# EAGLE schematic Adafruit ItsyBitsy nRF52840 Express (EAGLE 9.6.2)
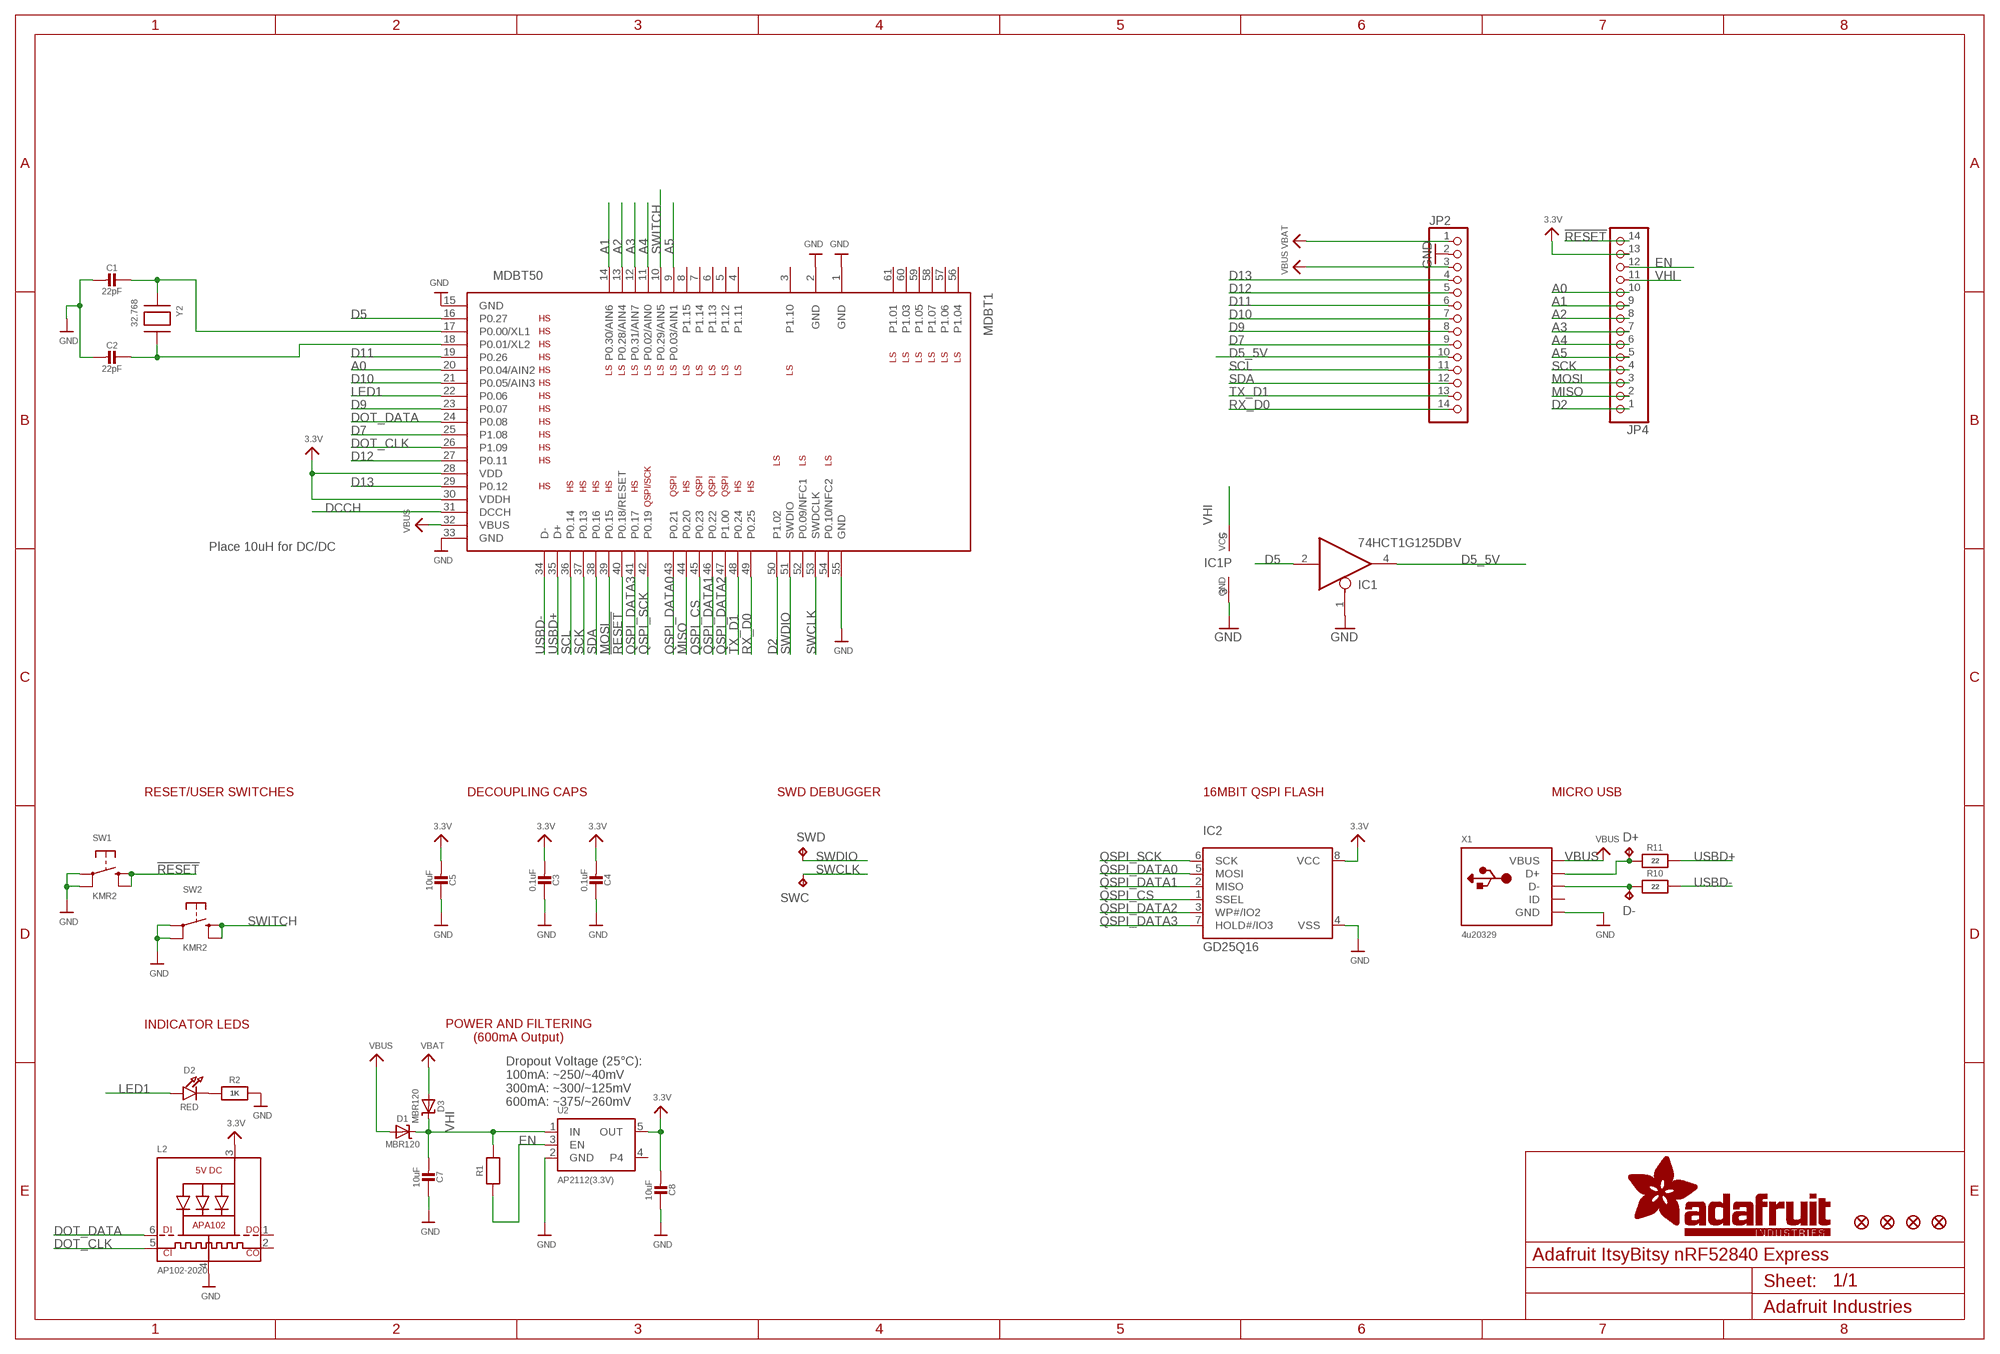
[diagram p0: schematic, sheet 1]

## Parts
C1  22pF  CAP_CERAMIC_0603MP  [_0603MP]
C2  22pF  CAP_CERAMIC_0603MP  [_0603MP]
C3  0.1uF  CAP_CERAMIC0603_NO  [0603-NO]
C4  0.1uF  CAP_CERAMIC0603_NO  [0603-NO]
C5  10uF  CAP_CERAMIC0805-NOOUTLINE  [0805-NO]
C7  10uF  CAP_CERAMIC0805-NOOUTLINE  [0805-NO]
C8  10uF  CAP_CERAMIC0805-NOOUTLINE  [0805-NO]
D1  MBR120  DIODE-SCHOTTKYSOD-123  [SOD-123]
D2  RED  LED0805_NOOUTLINE  [CHIPLED_0805_NOOUTLINE]
D3  MBR120  DIODE-SCHOTTKYSOD-123  [SOD-123]
D+  TPTP10R  [TP10R]
D-  TPTP10R  [TP10R]
FID1  FIDUCIAL_1MM  [FIDUCIAL_1MM]
FID2  FIDUCIAL_1MM  [FIDUCIAL_1MM]
FID3  FIDUCIAL_1MM  [FIDUCIAL_1MM]
FID4  FIDUCIAL_1MM  [FIDUCIAL_1MM]
IC1  74HCT1G125DBV  74AHC1G125DBV  [SOT23-5]
IC2  GD25Q16  SPIFLASH_8PINUX  [USON8]
JP2  HEADER-1X14  [1X14_ROUND70]
JP4  HEADER-1X14  [1X14_ROUND70]
L2  AP102-2020  APA1022020  [APA102_2020]
MDBT1  MDBT50  [MDBT50]
R1  10K  RESISTOR_0603_NOOUT  [0603-NO]
R2  1K  RESISTOR_0603_NOOUT  [0603-NO]
R10  22  RESISTOR_0603_NOOUT  [0603-NO]
R11  22  RESISTOR_0603_NOOUT  [0603-NO]
SW1  KMR2  SWITCH_TACT_SMT4.6X2.8  [BTN_KMR2_4.6X2.8]
SW2  KMR2  SWITCH_TACT_SMT4.6X2.8  [BTN_KMR2_4.6X2.8]
SWC  TPTP13R  [TP13R]
SWD  TPTP13R  [TP13R]
U2  AP2112(3.3V)  VREG_SOT23-5  [SOT23-5]
X1  4u20329  USB_MICRO_20329_V2  [4UCONN_20329_V2]
Y2  32.768  XTAL-3.2X1.5  [XTAL3215]

## Nets
3.3V [power]: C3.2 C4.2 C5.2 C8.2 IC2.8(VCC) JP4.13 L2.3(VDD) MDBT1.28(VDD) MDBT1.30(VDDH) U2.5(OUT)
!RESET: JP4.14 MDBT1.40(P0.18/RESET) SW1.B'(S1) SW1.B(S)
A0: JP4.10 MDBT1.20(P0.04/AIN2)
A1: JP4.9 MDBT1.14(P0.30/AIN6)
A2: JP4.8 MDBT1.13(P0.28/AIN4)
A3: JP4.7 MDBT1.12(P0.31/AIN7)
A4: JP4.6 MDBT1.11(P0.02/AIN0)
A5: JP4.5 MDBT1.9(P0.03/AIN1)
D2: JP4.1 MDBT1.50(P1.02)
D5: IC1.2(I) MDBT1.16(P0.27)
D5_5V: IC1.4(O) JP2.10
D7: JP2.9 MDBT1.25(P1.08)
D9: JP2.8 MDBT1.23(P0.07)
D10: JP2.7 MDBT1.21(P0.05/AIN3)
D11: JP2.6 MDBT1.19(P0.26)
D12: JP2.5 MDBT1.27(P0.11)
D13: JP2.4 MDBT1.29(P0.12)
D+: D+.TP R11.1 X1.D+
D-: D-.TP R10.1 X1.D-
DCCH: MDBT1.31(DCCH)
DOT_CLK: L2.5(CKI) MDBT1.26(P1.09)
DOT_DATA: L2.6(DI) MDBT1.24(P0.08)
EN: JP4.12 R1.1 U2.3(EN)
GND: C1.2 C2.2 C3.1 C4.1 C5.1 C7.1 C8.1 IC1.1(OE) IC1.3(GND) IC2.4(VSS) JP2.2 L2.4(GND) MDBT1.1(GND) MDBT1.2(GND) MDBT1.15(GND) MDBT1.33(GND) MDBT1.55(GND) R2.2 SW1.A'(P1) SW1.A(P) SW2.A'(P1) SW2.A(P) U2.2(GND) X1.BASE@1(GND) X1.BASE@2(GND) X1.GND X1.SPRT@1(GND) X1.SPRT@2(GND) X1.SPRT@3(GND) X1.SPRT@4(GND)
LED1: D2.A MDBT1.22(P0.06)
MISO: JP4.2 MDBT1.44(P0.20)
MOSI: JP4.3 MDBT1.39(P0.15)
N$1: D2.C R2.1
N$7: C1.1 MDBT1.17(P0.00/XL1) Y2.P$1
N$8: C2.1 MDBT1.18(P0.01/XL2) Y2.P$2
QSPI_CS: IC2.1(SSEL) MDBT1.45(P0.23)
QSPI_DATA0: IC2.5(MOSI) MDBT1.43(P0.21)
QSPI_DATA1: IC2.2(MISO) MDBT1.46(P0.22)
QSPI_DATA2: IC2.3(WP#/IO2) MDBT1.47(P1.00)
QSPI_DATA3: IC2.7(HOLD#/IO3) MDBT1.41(P0.17)
QSPI_SCK: IC2.6(SCK) MDBT1.42(P0.19)
RX_D0: JP2.14 MDBT1.49(P0.25)
SCK: JP4.4 MDBT1.37(P0.13)
SCL: JP2.11 MDBT1.36(P0.14)
SDA: JP2.12 MDBT1.38(P0.16)
SWCLK: MDBT1.53(SWDCLK) SWC.TP
SWDIO: MDBT1.51(SWDIO) SWD.TP
SWITCH: MDBT1.10(P0.29/AIN5) SW2.B'(S1) SW2.B(S)
TX_D1: JP2.13 MDBT1.48(P0.24)
USBD+: MDBT1.35(D+) R11.2
USBD-: MDBT1.34(D-) R10.2
VBAT [power]: D3.A JP2.1
VBUS [power]: D1.A JP2.3 MDBT1.32(VBUS) X1.VBUS
VHI [power]: C7.2 D1.C D3.C IC1.5(VCC) JP4.11 R1.2 U2.1(IN)
Unconnected: L2.1(DO) L2.2(CKO) MDBT1.3(P1.10) MDBT1.4(P1.11) MDBT1.5(P1.12) MDBT1.6(P1.13) MDBT1.7(P1.14) MDBT1.8(P1.15) MDBT1.52(P0.09/NFC1) MDBT1.54(P0.10/NFC2) MDBT1.56(P1.04) MDBT1.57(P1.06) MDBT1.58(P1.07) MDBT1.59(P1.05) MDBT1.60(P1.03) MDBT1.61(P1.01) U2.4 X1.ID

## Notes on the sheet
- Place 10uH for DC/DC
- RESET/USER SWITCHES | DECOUPLING CAPS | SWD DEBUGGER | 16MBIT QSPI FLASH | MICRO USB
- INDICATOR LEDS
- POWER AND FILTERING
  (600mA Output)
- Dropout Voltage (25°C):
  100mA: ~250/~40mV
  300mA: ~300/~125mV
  600mA: ~375/~260mV

## Library data of the parts
C1-C5 C7 C8 = microbuilder:CAP_CERAMIC: Ceramic Capacitors For new designs, use the packages preceded by an '_' character since they are more reliable: The following footprints should be used on most boards: _0402 - Standard footprint for regular board layouts _0603 - Standard footprint for regular board layouts _0805 - Standard footprint for regular board layouts _1206 - Standard footprint for regular board layouts For extremely tight-pitch boards where space is at a premium, the following 'micro-pitch' footprints can be used (smaller pads, no silkscreen outline, etc.): _0402MP - Micro-pitch footprint for very dense/compact boards _0603MP - Micro-pitch footprint for very dense/compact boards _0805MP - Micro-pitch footprint for very dense/compact boards _1206MP - Micro-pitch footprint for very dense/compact boards
D1 D3 = microbuilder:DIODE-SCHOTTKY
D2 = microbuilder:LED: LED 0603 - 0603 Surface Mount Package 2mA: Green LED - Low Power (3.9mcd, 2ma, 1.7Vf) - Digikey: 475-2709-2-ND Orange LED - Low Power (9.8mcd, 2ma, 1.8Vf) - Digikey: 475-1194-2-ND Red LED - Low Power (5mcd, 2ma, 1.8Vf) - Digikey: 475-1195-2-ND Yellow LED - Low Power (7mcd, 2ma, 1.8Vf) - Digikey: 475-1196-2-ND 5mA: Blue LED - Low Power (17mcd, 5ma, 2.9Vf) - Digikey: LNJ937W8CRACT-ND 0805 - 0805 Surface Mount Package 2mA: Red LED (8.8mcd, 2mA, 1.8Vf, Clear) - Low Power [Digikey: 475-2510-1-ND] Green LED (5mcd, 2mA, 1.8Vf, Clear) - Low Power [Digikey: 475-2730-1-ND] Yellow LED (11.3mcd, 2mA, 1.8Vf, Clear) - Low Power [Digikey: 475-2555-1-ND] 20mA: Red LED (104mcd, 20mA, Diffused) - LS R976 [Digikey: 475-1278-6-ND] Red LED (12mcd, 20mA, 2.0Vf, Clear) - APT2012EC [Digikey: 754-1128-1-ND] Green LED (15mcd, 20mA, 2.2Vf, Clear) - APT2012GC [Digikey: 754-1131-1-ND] Orange LED (160mcd, 20mA, 2.1Vf, Clear) - APT2012SECK [Digikey: 754-1130-1-ND] 1206 - 1206 Surface Mount Package Green LED (26mcd, 20mA, Diffused) - LG N971 [Digikey: 475-1407-6-ND] Red LED (15mcd, 20mA, Diffused) - LH N974 [Digikey: 475-1416-6-ND] Cree - Cree High-Power Surface Mount LEDs XPEBWT-L1-0000-00D50 - White 111lm 350mA 2.9Vf 6200K 110° XTEAWT-00-0000-00000LEE3 - White 114lm 350mA 2.85Vf 5000K 115° Everlight - Everlight 45-21 Series Surface Mount LEDs 45-21/QK2C-B2832AC2CB2/2T - Warm White 2000mcd 20mA 3.25Vf 3050K 120° 45-21/LK2C-B38452C4CB2/2T - Nuetral White 2000mcd 20mA 3.25Vf 4150K 120° 45-21/LK2C-B50634C6CB2/2T - Cold White 2200mcd 20mA 3.25Vf 5650K 120° PLCC2 Reverse Mount LS T77K-J1L2-1-0-2-R18-Z - Red 11.25mcd 2mA 1.8Vf 630nm 120° LO T77K-L1M2-24-Z - Orange 19.6mcd 2mA 1.8Vf 606nm 120° LY T77K-K2M1-26-Z - Yellow 15.7mcd 2mA 1.8Vf 587nm 120°
D+ D- SWC SWD = testpad:TP: Test pad
FID1-FID4 = microbuilder:FIDUCIAL: Fiducial Alignment Points Various fiducial points for machine vision alignment.; BOM: EXCLUDE
IC1 = 74xx-little-us:74*1G125: Single Bus Buffer Gate with 3-State Output
IC2 = microbuilder:SPIFLASH_8PIN: SOIC8 SPI Flash Be careful with the size since SOIC8 flash comes in several 'widths' SOIC8 150 mil M25P16 - 16Mbit (2Mbit x 8) Serial Flash (75MHz SPI Bus), Supply: 2.7-3.6V Digikey: SOIC8 - M25P16-VMN6P-ND SOIC8 208 mil W25Q16BVSSIG - 16Mbit (2Mbit x 8) Serial Flash (104MHz SPI Bus), Supply: 2.7-3.6V Digikey: SOIC8 - W25Q16BVSSIG-ND
JP2 JP4 = microbuilder:HEADER-1X14
L2 = microbuilder:APA102: APA102/DotStar Pixels VCC: 5V DC Refresh Rate: 400Hz
MDBT1 = microbuilder:MDBT50: Raytac Corporation MDBT50 Bluetooth Low Energy Module based on Noridc nRF52840 Source: Raytac datasheet
R1 R2 R10 R11 = microbuilder:RESISTOR: Resistors For new designs, use the packages preceded by an '_' character since they are more reliable: The following footprints should be used on most boards: _0402 - Standard footprint for regular board layouts _0603 - Standard footprint for regular board layouts _0805 - Standard footprint for regular board layouts _1206 - Standard footprint for regular board layouts For extremely tight-pitch boards where space is at a premium, the following 'micro-pitch' footprints can be used (smaller pads, no silkscreen outline, etc.): _0402MP - Micro-pitch footprint for very dense/compact boards _0603MP - Micro-pitch footprint for very dense/compact boards _0805MP - Micro-pitch footprint for very dense/compact boards _1206MP - Micro-pitch footprint for very dense/compact boards
SW1 SW2 = microbuilder:SWITCH_TACT_SMT: SMT Tact Switches 6x6mm - Digikey: P12940SCT-ND KMR2 (4.6x2.8mm) - Digikey: 401-1426-1-ND EVQ-PQHB55 - Light Touch, 160GF (4.5x4.5mm) - Digikey: P8090SCT-ND KMT0 - KMT021 NGJ LHS (etc.) IP68/Waterproof - Digikey: CKN10289CT-ND
U2 = microbuilder:VREG_SOT23-5: SOT23-5 Fixed Voltage Regulators Part Current Out V Out V In V Dropout θJA (°C/W) TJ (°C) Digikey Part No. ADP121 150mA 3.3V 3.4-5.5V 0.09V @ 150mA -- -- ADP121-AUJZ33R7CT-ND ADP121 150mA 3.0V 3.1-5.5V 0.09V @ 150mA -- -- ADP121-AUJZ30R7CT-ND ADP122 300mA 3.3V 3.4-5.5V 0.085V @ 300mA -- -- ADP122AUJZ-3.3-R7CT-ND ADP1712 300mA 3.3V 3.5-5.5V 0.17V @ 300mA -- -- ADP1712AUJZ-3.3-R7TR-ND AP7311 (Low Cost) 150mA 3.3V 3.5-6V 0.15V @ 150mA -- -- AP7311-33WG-7DICT-ND LD39015M18R 150mA 1.8V 1.9V-5.5V 0.08V @ 100mA -- -- 497-6977-1-ND LP2985A-33DBVR 150mA 3.3V 3.3-16V 0.28V @ 150mA 206 150 296-18479-1-ND MCP1824T-3302E/OT 300mA 3.3V 3.5V-6V 0.2V @ 300mA -- -- MCP1824T-3302E/OTCT-ND MIC5205-2.5YM5 TR 150mA 2.5V 2.7-16V 0.165V @ 150mA -- -- 576-1257-2-ND MIC5205-3.0YM5 TR 150mA 3.0V 3.2V-16V 0.165V @ 150mA -- -- 576-1258-2-ND MIC5205-3.3YM5 TR 150mA 3.3V 3.5V-16V 0.165V @ 150mA -- -- 576-1259-2-ND TPS780330220 150mA 3.3V+2.2V 3.6-5.5V 250mV Max -- -- 296-23332-1-ND TDA3663/N1,135 100mA 3.3V 3.5-45V 0.18V @ 50mA -- -- 568-5343-1-ND Max operating temp can be calculated using θJA, TJ (max junction temperature), and power in watts. Set the "Maximum Ambient Temperature" until it reaches TJ ("Max Junction Temperature"), which is the absolute limit for safe use of the regulator: Heat Sink Temperature Calculator <http://www.daycounter.com/Calculators/Heat-Sink-Temperature-Calculator.phtml> For example, With 12V source into a 3.3V LP2985 and a 30mA load, we are dissipating (12V-3.3V) * 0.03A = 0.261W. With a θJA of 206 °C/W, a TJ of 150°C, and 261mW we can safely use the chip without a heat sink up to 75°C (=147.1°C Junction Temperature).
X1 = microbuilder:USB: USB Connectors USBMINIB - Surface Mount Female Mini-B USB Connector 4UConnector: 06564
Y2 = adafruit2:XTAL: Low cost SMT crystals, no capacitors included http://www.ladyada.net/library/eagle

## Net classes
1 power: width 0.254 mm